# Altium project IOT_IO_v0.PrjPcb
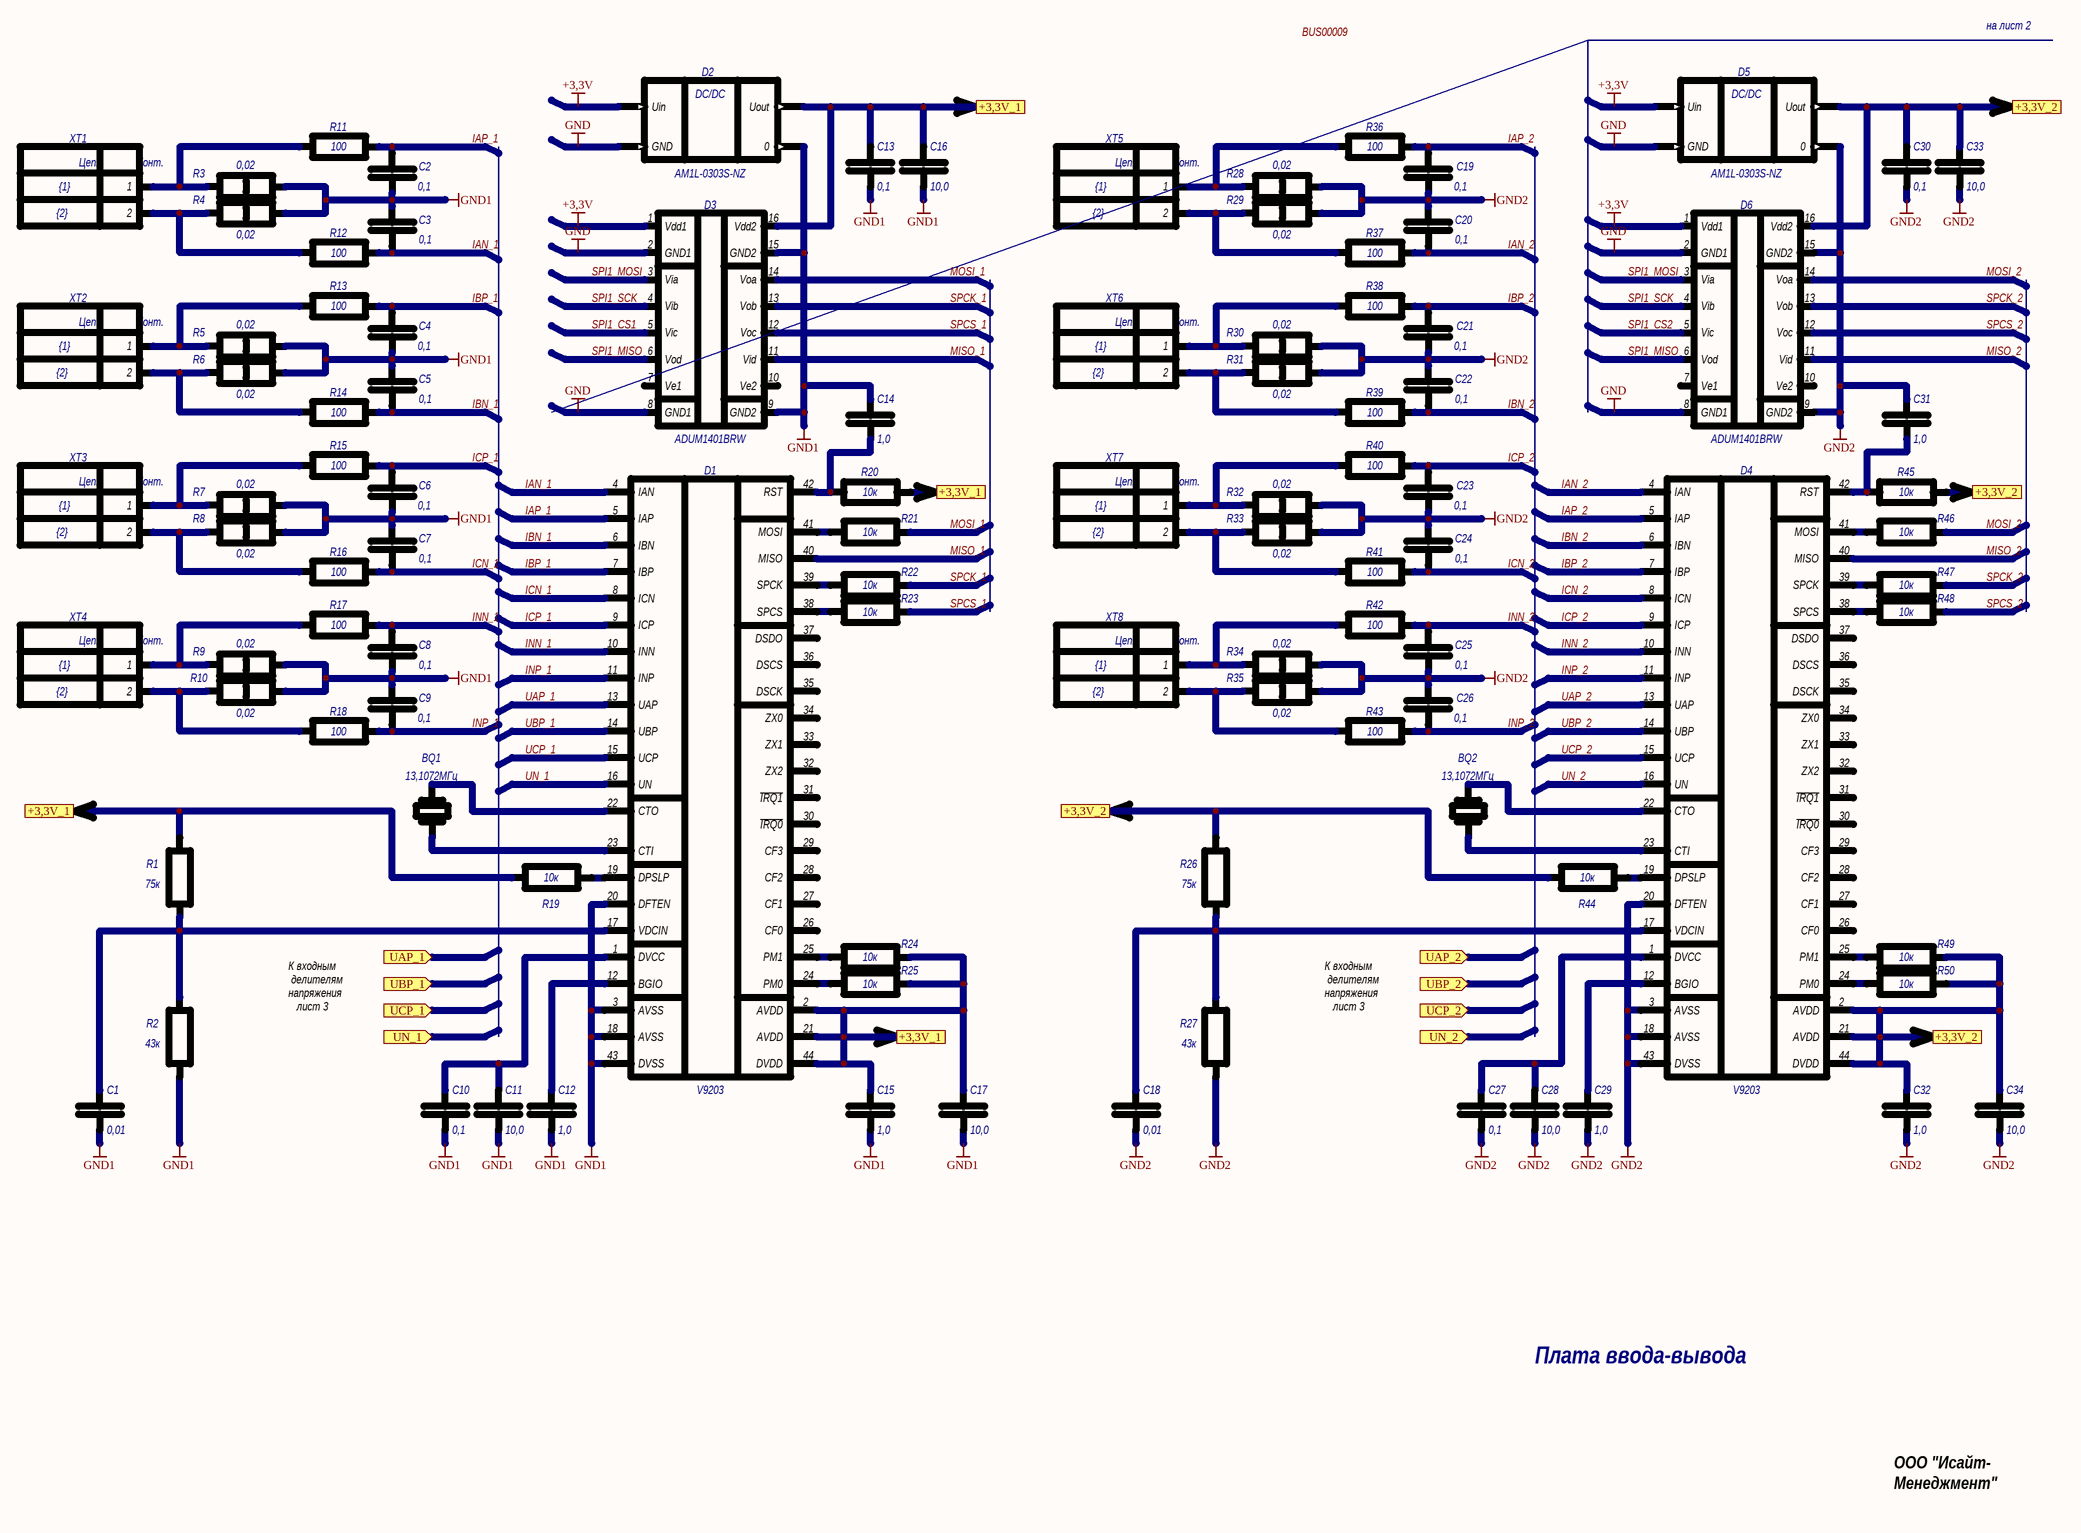
[diagram p0: Sheet1.SCHDOC]
3 sheets, 264 parts. Net scope: global (net labels, ports and power ports of the same name join across sheets).
Board file: IOT_IO_v0.PcbDoc
Sheets:
  Sheet1.SCHDOC
  Sheet3.SCHDOC
  Sheet4.SCHDOC

## Sheet Sheet1.SCHDOC
size 593 x 439 mm; ApprovedBy: ГрибановСВ; CheckedBy: КычкинАВ; Author: СергеевДС; DocumentNumber: ЕМС.02.00.100 Э3; SheetNumber: 1; SheetTotal: 4; DocumentName: Sheet1.SCHDOC

### Parts
BQ1  HC49U-12M  [HC49U]  (value not drawn)
BQ2  HC49U-12M  [HC49U]  (value not drawn)
C1  value 0,01  [0805]  (hidden comment: К0805)
C2  value 0,1  [0805]  (hidden comment: К0805)
C3  value 0,1  [0805]  (hidden comment: К0805)
C4  value 0,1  [0805]  (hidden comment: К0805)
C5  value 0,1  [0805]  (hidden comment: К0805)
C6  value 0,1  [0805]  (hidden comment: К0805)
C7  value 0,1  [0805]  (hidden comment: К0805)
C8  value 0,1  [0805]  (hidden comment: К0805)
C9  value 0,1  [0805]  (hidden comment: К0805)
C10  value 0,1  [0805]  (hidden comment: К0805)
C11  value 10,0  [0805]  (hidden comment: К0805)
C12  value 1,0  [0805]  (hidden comment: К0805)
C13  value 0,1  [0805]  (hidden comment: К0805)
C14  value 1,0  [0805]  (hidden comment: К0805)
C15  value 1,0  [0805]  (hidden comment: К0805)
C16  value 10,0  [0805]  (hidden comment: К0805)
C17  value 10,0  [0805]  (hidden comment: К0805)
C18  value 0,01  [0805]  (hidden comment: К0805)
C19  value 0,1  [0805]  (hidden comment: К0805)
C20  value 0,1  [0805]  (hidden comment: К0805)
C21  value 0,1  [0805]  (hidden comment: К0805)
C22  value 0,1  [0805]  (hidden comment: К0805)
C23  value 0,1  [0805]  (hidden comment: К0805)
C24  value 0,1  [0805]  (hidden comment: К0805)
C25  value 0,1  [0805]  (hidden comment: К0805)
C26  value 0,1  [0805]  (hidden comment: К0805)
C27  value 0,1  [0805]  (hidden comment: К0805)
C28  value 10,0  [0805]  (hidden comment: К0805)
C29  value 1,0  [0805]  (hidden comment: К0805)
C30  value 0,1  [0805]  (hidden comment: К0805)
C31  value 1,0  [0805]  (hidden comment: К0805)
C32  value 1,0  [0805]  (hidden comment: К0805)
C33  value 10,0  [0805]  (hidden comment: К0805)
C34  value 10,0  [0805]  (hidden comment: К0805)
D1  V9203  [TQFP-44]
D2  value AM1L-0303S-NZ  [SIP-4]  (hidden comment: TME0505S)
D3  ADUM1401BRW  [SOL-16]
D4  V9203  [TQFP-44]
D5  value AM1L-0303S-NZ  [SIP-4]  (hidden comment: TME0505S)
D6  ADUM1401BRW  [SOL-16]
R1  Р0805  [0805]  (value not drawn)
R2  Р0805  [0805]  (value not drawn)
R3  value 0,02  [2512]  (hidden comment: Р2512)
R4  value 0,02  [2512]  (hidden comment: Р2512)
R5  value 0,02  [2512]  (hidden comment: Р2512)
R6  value 0,02  [2512]  (hidden comment: Р2512)
R7  value 0,02  [2512]  (hidden comment: Р2512)
R8  value 0,02  [2512]  (hidden comment: Р2512)
R9  value 0,02  [2512]  (hidden comment: Р2512)
R10  value 0,02  [2512]  (hidden comment: Р2512)
R11  value 100  [0805]  (hidden comment: Р0805)
R12  value 100  [0805]  (hidden comment: Р0805)
R13  value 100  [0805]  (hidden comment: Р0805)
R14  value 100  [0805]  (hidden comment: Р0805)
R15  value 100  [0805]  (hidden comment: Р0805)
R16  value 100  [0805]  (hidden comment: Р0805)
R17  value 100  [0805]  (hidden comment: Р0805)
R18  value 100  [0805]  (hidden comment: Р0805)
R19  Р0805  [0805]  (value not drawn)
R20  Р0805  [0805]  (value not drawn)
R21  Р0805  [0805]  (value not drawn)
R22  Р0805  [0805]  (value not drawn)
R23  Р0805  [0805]  (value not drawn)
R24  Р0805  [0805]  (value not drawn)
R25  Р0805  [0805]  (value not drawn)
R26  Р0805  [0805]  (value not drawn)
R27  Р0805  [0805]  (value not drawn)
R28  value 0,02  [2512]  (hidden comment: Р2512)
R29  value 0,02  [2512]  (hidden comment: Р2512)
R30  value 0,02  [2512]  (hidden comment: Р2512)
R31  value 0,02  [2512]  (hidden comment: Р2512)
R32  value 0,02  [2512]  (hidden comment: Р2512)
R33  value 0,02  [2512]  (hidden comment: Р2512)
R34  value 0,02  [2512]  (hidden comment: Р2512)
R35  value 0,02  [2512]  (hidden comment: Р2512)
R36  value 100  [0805]  (hidden comment: Р0805)
R37  value 100  [0805]  (hidden comment: Р0805)
R38  value 100  [0805]  (hidden comment: Р0805)
R39  value 100  [0805]  (hidden comment: Р0805)
R40  value 100  [0805]  (hidden comment: Р0805)
R41  value 100  [0805]  (hidden comment: Р0805)
R42  value 100  [0805]  (hidden comment: Р0805)
R43  value 100  [0805]  (hidden comment: Р0805)
R44  Р0805  [0805]  (value not drawn)
R45  Р0805  [0805]  (value not drawn)
R46  Р0805  [0805]  (value not drawn)
R47  Р0805  [0805]  (value not drawn)
R48  Р0805  [0805]  (value not drawn)
R49  Р0805  [0805]  (value not drawn)
R50  Р0805  [0805]  (value not drawn)
XT1  2: {2}  1: {1}  [EK508V-02P]  (hidden comment: EK508V-02P)
XT2  2: {2}  1: {1}  [EK508V-02P]  (hidden comment: EK508V-02P)
XT3  2: {2}  1: {1}  [EK508V-02P]  (hidden comment: EK508V-02P)
XT4  2: {2}  1: {1}  [EK508V-02P]  (hidden comment: EK508V-02P)
XT5  2: {2}  1: {1}  [EK508V-02P]  (hidden comment: EK508V-02P)
XT6  2: {2}  1: {1}  [EK508V-02P]  (hidden comment: EK508V-02P)
XT7  2: {2}  1: {1}  [EK508V-02P]  (hidden comment: EK508V-02P)
XT8  2: {2}  1: {1}  [EK508V-02P]  (hidden comment: EK508V-02P)

### Ports
+3,3V_1, +3,3V_2, UAP_1 (in), UAP_2 (in), UBP_1 (in), UBP_2 (in), UCP_1 (in), UCP_2 (in), UN_1 (in), UN_2 (in)

### Nets
+3,3V: D2.2(Uin) D3.1(Vdd1) D5.2(Uin) D6.1(Vdd1)
GND: D2.1(GND) D3.2(GND1) D3.8(GND1) D5.1(GND) D6.2(GND1) D6.8(GND1)
GND1: C1.1 C2.2 C3.2 C4.2 C5.2 C6.2 C7.2 C8.1 C9.1 C10.1 C11.1 C12.1 C13.1 C14.2 C15.1 C16.1 C17.1 D1.3(AVSS) D1.18(AVSS) D1.20(DFTEN) D1.43(DVSS) D2.3(0) D3.9(GND2) D3.15(GND2) R2.1 R3.2 R4.2 R5.2 R6.2 R7.2 R8.2 R9.2 R10.2
GND2: C18.1 C19.2 C20.2 C21.2 C22.2 C23.2 C24.2 C25.1 C26.1 C27.1 C28.1 C29.1 C30.1 C31.2 C32.1 C33.1 C34.1 D4.3(AVSS) D4.18(AVSS) D4.20(DFTEN) D4.43(DVSS) D5.3(0) D6.9(GND2) D6.15(GND2) R27.1 R28.2 R29.2 R30.2 R31.2 R32.2 R33.2 R34.2 R35.2
+3,3V_1: C13.2 C15.2 C16.2 C17.2 D1.2(AVDD) D1.21(AVDD) D1.44(DVDD) D2.4(Uout) D3.16(Vdd2) R1.2 R19.2 R20.2 R24.1 R25.1 ; port +3,3V_1
+3,3V_2: C30.2 C32.2 C33.2 C34.2 D4.2(AVDD) D4.21(AVDD) D4.44(DVDD) D5.4(Uout) D6.16(Vdd2) R26.2 R44.2 R45.2 R49.1 R50.1 ; port +3,3V_2
IAN_1: C3.1 D1.4(IAN) R12.1
IAN_2: C20.1 D4.4(IAN) R37.1
IAP_1: C2.1 D1.5(IAP) R11.1
IAP_2: C19.1 D4.5(IAP) R36.1
IBN_1: C5.1 D1.6(IBN) R14.1
IBN_2: C22.1 D4.6(IBN) R39.1
IBP_1: C4.1 D1.7(IBP) R13.1
IBP_2: C21.1 D4.7(IBP) R38.1
ICN_1: C7.1 D1.8(ICN) R16.1
ICN_2: C24.1 D4.8(ICN) R41.1
ICP_1: C6.1 D1.9(ICP) R15.1
ICP_2: C23.1 D4.9(ICP) R40.1
INN_1: C8.2 D1.10(INN) R17.1
INN_2: C25.2 D4.10(INN) R42.1
INP_1: C9.2 D1.11(INP) R18.1
INP_2: C26.2 D4.11(INP) R43.1
MISO_1: D1.40(MISO) D3.11(Vid)
MISO_2: D4.40(MISO) D6.11(Vid)
MOSI_1: D3.14(Voa) R21.1
MOSI_2: D6.14(Voa) R46.1
SPCK_1: D3.13(Vob) R22.1
SPCK_2: D6.13(Vob) R47.1
SPCS_1: D3.12(Voc) R23.1
SPCS_2: D6.12(Voc) R48.1
SPI1_CS1: D3.5(Vic)
SPI1_CS2: D6.5(Vic)
SPI1_MISO: D3.6(Vod) D6.6(Vod)
SPI1_MOSI: D3.3(Via) D6.3(Via)
SPI1_SCK: D3.4(Vib) D6.4(Vib)
UAP_1: D1.13(UAP)
UAP_2: D4.13(UAP)
UBP_1: D1.14(UBP)
UBP_2: D4.14(UBP)
UCP_1: D1.15(UCP)
UCP_2: D4.15(UCP)
UN_1: D1.16(UN)
UN_2: D4.16(UN)
NetBQ1_1: BQ1.1 D1.23(CTI)
NetBQ1_2: BQ1.2 D1.22(CTO)
NetBQ2_1: BQ2.1 D4.23(CTI)
NetBQ2_2: BQ2.2 D4.22(CTO)
NetC1_2: C1.2 D1.17(VDCIN) R1.1 R2.2
NetC10_2: C10.2 C11.2 D1.1(DVCC)
NetC12_2: C12.2 D1.12(BGIO)
NetC14_1: C14.1 D1.42(RST) R20.1
NetC18_2: C18.2 D4.17(VDCIN) R26.1 R27.2
NetC27_2: C27.2 C28.2 D4.1(DVCC)
NetC29_2: C29.2 D4.12(BGIO)
NetC31_1: C31.1 D4.42(RST) R45.1
NetD1_19: D1.19(DPSLP) R19.1
NetD1_24: D1.24(PM0) R25.2
NetD1_25: D1.25(PM1) R24.2
NetD1_38: D1.38(SPCS) R23.2
NetD1_39: D1.39(SPCK) R22.2
NetD1_41: D1.41(MOSI) R21.2
NetD4_19: D4.19(DPSLP) R44.1
NetD4_24: D4.24(PM0) R50.2
NetD4_25: D4.25(PM1) R49.2
NetD4_38: D4.38(SPCS) R48.2
NetD4_39: D4.39(SPCK) R47.2
NetD4_41: D4.41(MOSI) R46.2
NetR3_1: R3.1 R11.2 XT1.1
NetR4_1: R4.1 R12.2 XT1.2
NetR5_1: R5.1 R13.2 XT2.1
NetR6_1: R6.1 R14.2 XT2.2
NetR7_1: R7.1 R15.2 XT3.1
NetR8_1: R8.1 R16.2 XT3.2
NetR9_1: R9.1 R17.2 XT4.1
NetR10_1: R10.1 R18.2 XT4.2
NetR28_1: R28.1 R36.2 XT5.1
NetR29_1: R29.1 R37.2 XT5.2
NetR30_1: R30.1 R38.2 XT6.1
NetR31_1: R31.1 R39.2 XT6.2
NetR32_1: R32.1 R40.2 XT7.1
NetR33_1: R33.1 R41.2 XT7.2
NetR34_1: R34.1 R42.2 XT8.1
NetR35_1: R35.1 R43.2 XT8.2

Not connected (* = marked no-connect by the designer): D1 26(CF0) 27(CF1) 28(CF2) 29(CF3) 30(~{IRQ0}) 31(~{IRQ1}) 32(ZX2) 33(ZX1) 34(ZX0) 35(DSCK) 36(DSCS) 37(DSDO); D3 7(Ve1) 10(Ve2); D4 26(CF0) 27(CF1) 28(CF2) 29(CF3) 30(~{IRQ0}) 31(~{IRQ1}) 32(ZX2) 33(ZX1) 34(ZX0) 35(DSCK) 36(DSCS) 37(DSDO); D6 7(Ve1) 10(Ve2)

### Notes on the sheet
- на лист 2
- К входным
  делителям
  напряжения
  лист 3
- Плата ввода-вывода
- ООО "Исайт-
  Менеджмент"
- Labels drawn without touching a wire or pin: BUS00009
- Перв. примен.
- Справ. №
- Подп. и дата
- Инв. № дубл.
- Взам. инв. №
- Изм.
- Лист
- № докум.
- Подп.
- Дата
- Литера
- Масса
- Масштаб
- Пров.
- Разраб.
- О
- 1
- _
- Инв. № подл.
- Н.контр.
- Схема электрическая
  принципиальная
- Листов
- Утв.
- (in symbol EK508V-02P) Цепь; Конт.
- (in symbol HC49U-12M) 13,1072МГц
- (in symbol TME0505S) DC/DC
- (in symbol Р0805) 43к; 75к
- (in symbol Р0805_VARIANT_1) 10к

### Library data of the parts
BQ1 BQ2 = HC49U-12M: РЕЗОНАТОР; TG: {TG}; TO: 020, 211/-/12.0М; TU: {TU}; NO: 0524; RefDes2: {RefDes2}; ComponentHeight: {ComponentHeight}
C1-C34 = К0805: КОНДЕНСАТОР; TG: NP0; TO: 5%; TU: {TU}; NO: {NO}; RefDes2: {RefDes2}; ComponentHeight: 1
D1 D4 = V9203: {Description}; TG: {TG}; NO: {NO}; RefDes2: {RefDes2}; TU: {TU}; TO: {TO}; ComponentHeight: {ComponentHeight}
D2 D5 = TME0505S: МИКРОСХЕМА; TO: 320/SIP-4/SZ; TU: TRACO, AIMTEC; NO: 0007; RefDes2: {RefDes2}; ComponentHeight: 10
R1 R2 R26 R27 = Р0805: РЕЗИСТОР; TG: 0,125; TO: 1%; TU: {TU}; NO: {NO}; RefDes2: {RefDes2}; ComponentHeight: 1
R3-R10 R28-R35 = Р2512: РЕЗИСТОР; TG: 1; TO: 5%; TU: {TU}; NO: {NO}; RefDes2: {RefDes2}; ComponentHeight: 1.2
R11-R25 R36-R50 = Р0805_VARIANT_1: РЕЗИСТОР; TG: 0,125; TO: 1%; TU: {TU}; NO: {NO}; RefDes2: {RefDes2}; ComponentHeight: 1
XT1-XT8 = EK508V-02P: {Description}; Value: 5.08; TU: {TU}; TG: {TG}; RefDes2: {RefDes2}; TO: {TO}; NO: {NO}; N1: {N1}; N2: {N2}; ComponentHeight: {ComponentHeight}

## Sheet Sheet3.SCHDOC
size 593 x 439 mm; DocumentNumber: ЕМС.02.00.100 Э3; SheetNumber: 3; SheetTotal: 4; DocumentName: Sheet3.SCHDOC
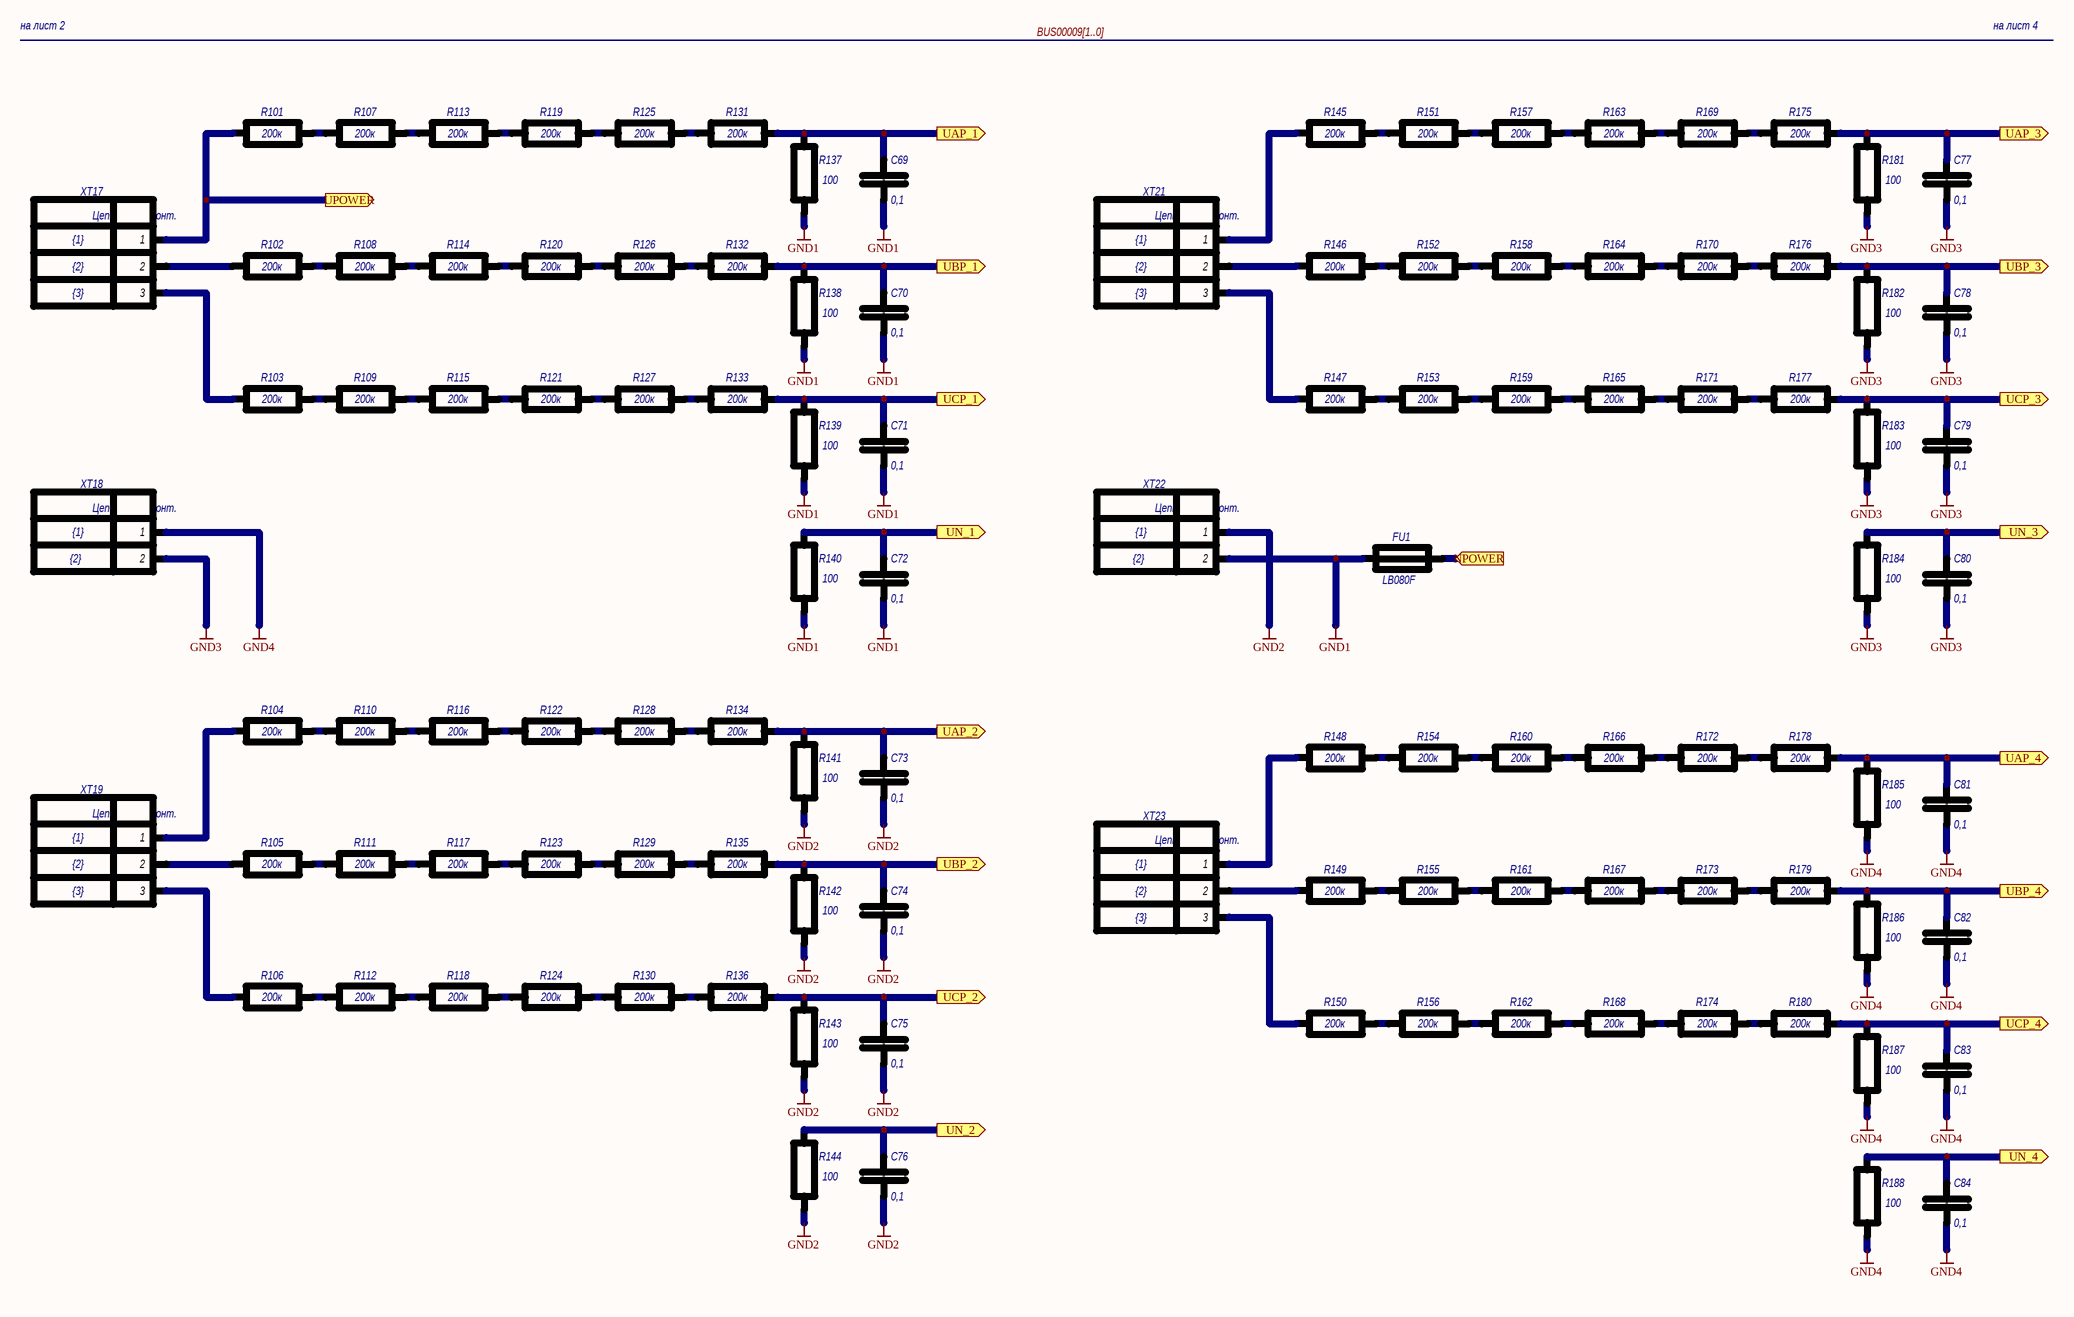
[diagram p1: Sheet3.SCHDOC]

### Parts
C69  value 0,1  [0805]  (hidden comment: К0805)
C70  value 0,1  [0805]  (hidden comment: К0805)
C71  value 0,1  [0805]  (hidden comment: К0805)
C72  value 0,1  [0805]  (hidden comment: К0805)
C73  value 0,1  [0805]  (hidden comment: К0805)
C74  value 0,1  [0805]  (hidden comment: К0805)
C75  value 0,1  [0805]  (hidden comment: К0805)
C76  value 0,1  [0805]  (hidden comment: К0805)
C77  value 0,1  [0805]  (hidden comment: К0805)
C78  value 0,1  [0805]  (hidden comment: К0805)
C79  value 0,1  [0805]  (hidden comment: К0805)
C80  value 0,1  [0805]  (hidden comment: К0805)
C81  value 0,1  [0805]  (hidden comment: К0805)
C82  value 0,1  [0805]  (hidden comment: К0805)
C83  value 0,1  [0805]  (hidden comment: К0805)
C84  value 0,1  [0805]  (hidden comment: К0805)
FU1  LB080F  [LB080F]
R101  Р1206  [1206]  (value not drawn)
R102  Р1206  [1206]  (value not drawn)
R103  Р1206  [1206]  (value not drawn)
R104  Р1206  [1206]  (value not drawn)
R105  Р1206  [1206]  (value not drawn)
R106  Р1206  [1206]  (value not drawn)
R107  Р1206  [1206]  (value not drawn)
R108  Р1206  [1206]  (value not drawn)
R109  Р1206  [1206]  (value not drawn)
R110  Р1206  [1206]  (value not drawn)
R111  Р1206  [1206]  (value not drawn)
R112  Р1206  [1206]  (value not drawn)
R113  Р1206  [1206]  (value not drawn)
R114  Р1206  [1206]  (value not drawn)
R115  Р1206  [1206]  (value not drawn)
R116  Р1206  [1206]  (value not drawn)
R117  Р1206  [1206]  (value not drawn)
R118  Р1206  [1206]  (value not drawn)
R119  Р1206  [1206]  (value not drawn)
R120  Р1206  [1206]  (value not drawn)
R121  Р1206  [1206]  (value not drawn)
R122  Р1206  [1206]  (value not drawn)
R123  Р1206  [1206]  (value not drawn)
R124  Р1206  [1206]  (value not drawn)
R125  Р1206  [1206]  (value not drawn)
R126  Р1206  [1206]  (value not drawn)
R127  Р1206  [1206]  (value not drawn)
R128  Р1206  [1206]  (value not drawn)
R129  Р1206  [1206]  (value not drawn)
R130  Р1206  [1206]  (value not drawn)
R131  Р1206  [1206]  (value not drawn)
R132  Р1206  [1206]  (value not drawn)
R133  Р1206  [1206]  (value not drawn)
R134  Р1206  [1206]  (value not drawn)
R135  Р1206  [1206]  (value not drawn)
R136  Р1206  [1206]  (value not drawn)
R137  value 100  [0805]  (hidden comment: Р0805)
R138  value 100  [0805]  (hidden comment: Р0805)
R139  value 100  [0805]  (hidden comment: Р0805)
R140  value 100  [0805]  (hidden comment: Р0805)
R141  value 100  [0805]  (hidden comment: Р0805)
R142  value 100  [0805]  (hidden comment: Р0805)
R143  value 100  [0805]  (hidden comment: Р0805)
R144  value 100  [0805]  (hidden comment: Р0805)
R145  Р1206  [1206]  (value not drawn)
R146  Р1206  [1206]  (value not drawn)
R147  Р1206  [1206]  (value not drawn)
R148  Р1206  [1206]  (value not drawn)
R149  Р1206  [1206]  (value not drawn)
R150  Р1206  [1206]  (value not drawn)
R151  Р1206  [1206]  (value not drawn)
R152  Р1206  [1206]  (value not drawn)
R153  Р1206  [1206]  (value not drawn)
R154  Р1206  [1206]  (value not drawn)
R155  Р1206  [1206]  (value not drawn)
R156  Р1206  [1206]  (value not drawn)
R157  Р1206  [1206]  (value not drawn)
R158  Р1206  [1206]  (value not drawn)
R159  Р1206  [1206]  (value not drawn)
R160  Р1206  [1206]  (value not drawn)
R161  Р1206  [1206]  (value not drawn)
R162  Р1206  [1206]  (value not drawn)
R163  Р1206  [1206]  (value not drawn)
R164  Р1206  [1206]  (value not drawn)
R165  Р1206  [1206]  (value not drawn)
R166  Р1206  [1206]  (value not drawn)
R167  Р1206  [1206]  (value not drawn)
R168  Р1206  [1206]  (value not drawn)
R169  Р1206  [1206]  (value not drawn)
R170  Р1206  [1206]  (value not drawn)
R171  Р1206  [1206]  (value not drawn)
R172  Р1206  [1206]  (value not drawn)
R173  Р1206  [1206]  (value not drawn)
R174  Р1206  [1206]  (value not drawn)
R175  Р1206  [1206]  (value not drawn)
R176  Р1206  [1206]  (value not drawn)
R177  Р1206  [1206]  (value not drawn)
R178  Р1206  [1206]  (value not drawn)
R179  Р1206  [1206]  (value not drawn)
R180  Р1206  [1206]  (value not drawn)
R181  value 100  [0805]  (hidden comment: Р0805)
R182  value 100  [0805]  (hidden comment: Р0805)
R183  value 100  [0805]  (hidden comment: Р0805)
R184  value 100  [0805]  (hidden comment: Р0805)
R185  value 100  [0805]  (hidden comment: Р0805)
R186  value 100  [0805]  (hidden comment: Р0805)
R187  value 100  [0805]  (hidden comment: Р0805)
R188  value 100  [0805]  (hidden comment: Р0805)
XT17  2: {2}  1: {1}  3: {3}  [EK508V-03P]  (hidden comment: EK508V-03P)
XT18  2: {2}  1: {1}  [EK508V-02P]  (hidden comment: EK508V-02P)
XT19  2: {2}  1: {1}  3: {3}  [EK508V-03P]  (hidden comment: EK508V-03P)
XT21  2: {2}  1: {1}  3: {3}  [EK508V-03P]  (hidden comment: EK508V-03P)
XT22  2: {2}  1: {1}  [EK508V-02P]  (hidden comment: EK508V-02P)
XT23  2: {2}  1: {1}  3: {3}  [EK508V-03P]  (hidden comment: EK508V-03P)

### Ports
NPOWER (in), UAP_1 (out), UAP_2 (out), UAP_3 (out), UAP_4 (out), UBP_1 (out), UBP_2 (out), UBP_3 (out), UBP_4 (out), UCP_1 (out), UCP_2 (out), UCP_3 (out), UCP_4 (out), UN_1 (out), UN_2 (out), UN_3 (out), UN_4 (out), UPOWER (out)

### Nets
GND1: C69.1 C70.1 C71.1 C72.1 FU1.1 R137.1 R138.1 R139.1 R140.1 XT22.2
GND2: C73.1 C74.1 C75.1 C76.1 R141.1 R142.1 R143.1 R144.1 XT22.1
GND3: C77.1 C78.1 C79.1 C80.1 R181.1 R182.1 R183.1 R184.1 XT18.2
GND4: C81.1 C82.1 C83.1 C84.1 R185.1 R186.1 R187.1 R188.1 XT18.1
NPOWER: FU1.2 ; port NPOWER
UAP_1: C69.2 R131.1 R137.2 ; port UAP_1
UAP_2: C73.2 R134.1 R141.2 ; port UAP_2
UAP_3: C77.2 R175.1 R181.2 ; port UAP_3
UAP_4: C81.2 R178.1 R185.2 ; port UAP_4
UBP_1: C70.2 R132.1 R138.2 ; port UBP_1
UBP_2: C74.2 R135.1 R142.2 ; port UBP_2
UBP_3: C78.2 R176.1 R182.2 ; port UBP_3
UBP_4: C82.2 R179.1 R186.2 ; port UBP_4
UCP_1: C71.2 R133.1 R139.2 ; port UCP_1
UCP_2: C75.2 R136.1 R143.2 ; port UCP_2
UCP_3: C79.2 R177.1 R183.2 ; port UCP_3
UCP_4: C83.2 R180.1 R187.2 ; port UCP_4
UN_1: C72.2 R140.2 ; port UN_1
UN_2: C76.2 R144.2 ; port UN_2
UN_3: C80.2 R184.2 ; port UN_3
UN_4: C84.2 R188.2 ; port UN_4
UPOWER: R101.1 XT17.1 ; port UPOWER
NetR101_2: R101.2 R107.1
NetR102_1: R102.1 XT17.2
NetR102_2: R102.2 R108.1
NetR103_1: R103.1 XT17.3
NetR103_2: R103.2 R109.1
NetR104_1: R104.1 XT19.1
NetR104_2: R104.2 R110.1
NetR105_1: R105.1 XT19.2
NetR105_2: R105.2 R111.1
NetR106_1: R106.1 XT19.3
NetR106_2: R106.2 R112.1
NetR107_2: R107.2 R113.1
NetR108_2: R108.2 R114.1
NetR109_2: R109.2 R115.1
NetR110_2: R110.2 R116.1
NetR111_2: R111.2 R117.1
NetR112_2: R112.2 R118.1
NetR113_2: R113.2 R119.2
NetR114_2: R114.2 R120.2
NetR115_2: R115.2 R121.2
NetR116_2: R116.2 R122.2
NetR117_2: R117.2 R123.2
NetR118_2: R118.2 R124.2
NetR119_1: R119.1 R125.2
NetR120_1: R120.1 R126.2
NetR121_1: R121.1 R127.2
NetR122_1: R122.1 R128.2
NetR123_1: R123.1 R129.2
NetR124_1: R124.1 R130.2
NetR125_1: R125.1 R131.2
NetR126_1: R126.1 R132.2
NetR127_1: R127.1 R133.2
NetR128_1: R128.1 R134.2
NetR129_1: R129.1 R135.2
NetR130_1: R130.1 R136.2
NetR145_1: R145.1 XT21.1
NetR145_2: R145.2 R151.1
NetR146_1: R146.1 XT21.2
NetR146_2: R146.2 R152.1
NetR147_1: R147.1 XT21.3
NetR147_2: R147.2 R153.1
NetR148_1: R148.1 XT23.1
NetR148_2: R148.2 R154.1
NetR149_1: R149.1 XT23.2
NetR149_2: R149.2 R155.1
NetR150_1: R150.1 XT23.3
NetR150_2: R150.2 R156.1
NetR151_2: R151.2 R157.1
NetR152_2: R152.2 R158.1
NetR153_2: R153.2 R159.1
NetR154_2: R154.2 R160.1
NetR155_2: R155.2 R161.1
NetR156_2: R156.2 R162.1
NetR157_2: R157.2 R163.2
NetR158_2: R158.2 R164.2
NetR159_2: R159.2 R165.2
NetR160_2: R160.2 R166.2
NetR161_2: R161.2 R167.2
NetR162_2: R162.2 R168.2
NetR163_1: R163.1 R169.2
NetR164_1: R164.1 R170.2
NetR165_1: R165.1 R171.2
NetR166_1: R166.1 R172.2
NetR167_1: R167.1 R173.2
NetR168_1: R168.1 R174.2
NetR169_1: R169.1 R175.2
NetR170_1: R170.1 R176.2
NetR171_1: R171.1 R177.2
NetR172_1: R172.1 R178.2
NetR173_1: R173.1 R179.2
NetR174_1: R174.1 R180.2

### Buses and harness runs
bus BUS00009[1..0]

### Notes on the sheet
- на лист 2
- на лист 4
- Подп. и дата
- Инв. № дубл.
- Взам. инв. №
- Инв. № подл.
- Лист
- Изм.
- № докум.
- Подп.
- Дата
- (in symbol EK508V-02P) Цепь; Конт.
- (in symbol EK508V-03P) Цепь; Конт.
- (in symbol Р1206) 200к

### Library data of the parts
C69-C84 = К0805: as C1 on sheet Sheet1; ComponentHeight: 1
FU1 = LB080F: {Description}; TU: {TU}; TG: {TG}; RefDes2: {RefDes2}; TO: {TO}; NO: {NO}; ComponentHeight: {ComponentHeight}
R101-R136 R145-R180 = Р1206: РЕЗИСТОР; TG: 0,25; TO: 5%; TU: {TU}; NO: {NO}; RefDes2: {RefDes2}; ComponentHeight: 1.2
R137-R144 R181-R188 = Р0805_VARIANT_1: as R11 on sheet Sheet1; ComponentHeight: 1
XT17 XT19 XT21 XT23 = EK508V-03P: {Description}; Value: 5.08; TU: {TU}; TG: {TG}; TO: {TO}; NO: {NO}; RefDes2: {RefDes2}; N1: {N1}; N2: {N2}; N3: {N3}; ComponentHeight: {ComponentHeight}
XT18 XT22 = EK508V-02P: as XT1 on sheet Sheet1; ComponentHeight: {ComponentHeight}

## Sheet Sheet4.SCHDOC
size 593 x 439 mm; DocumentNumber: ЕМС.02.00.100 Э3; SheetNumber: 4; SheetTotal: 4; DocumentName: Sheet4.SCHDOC
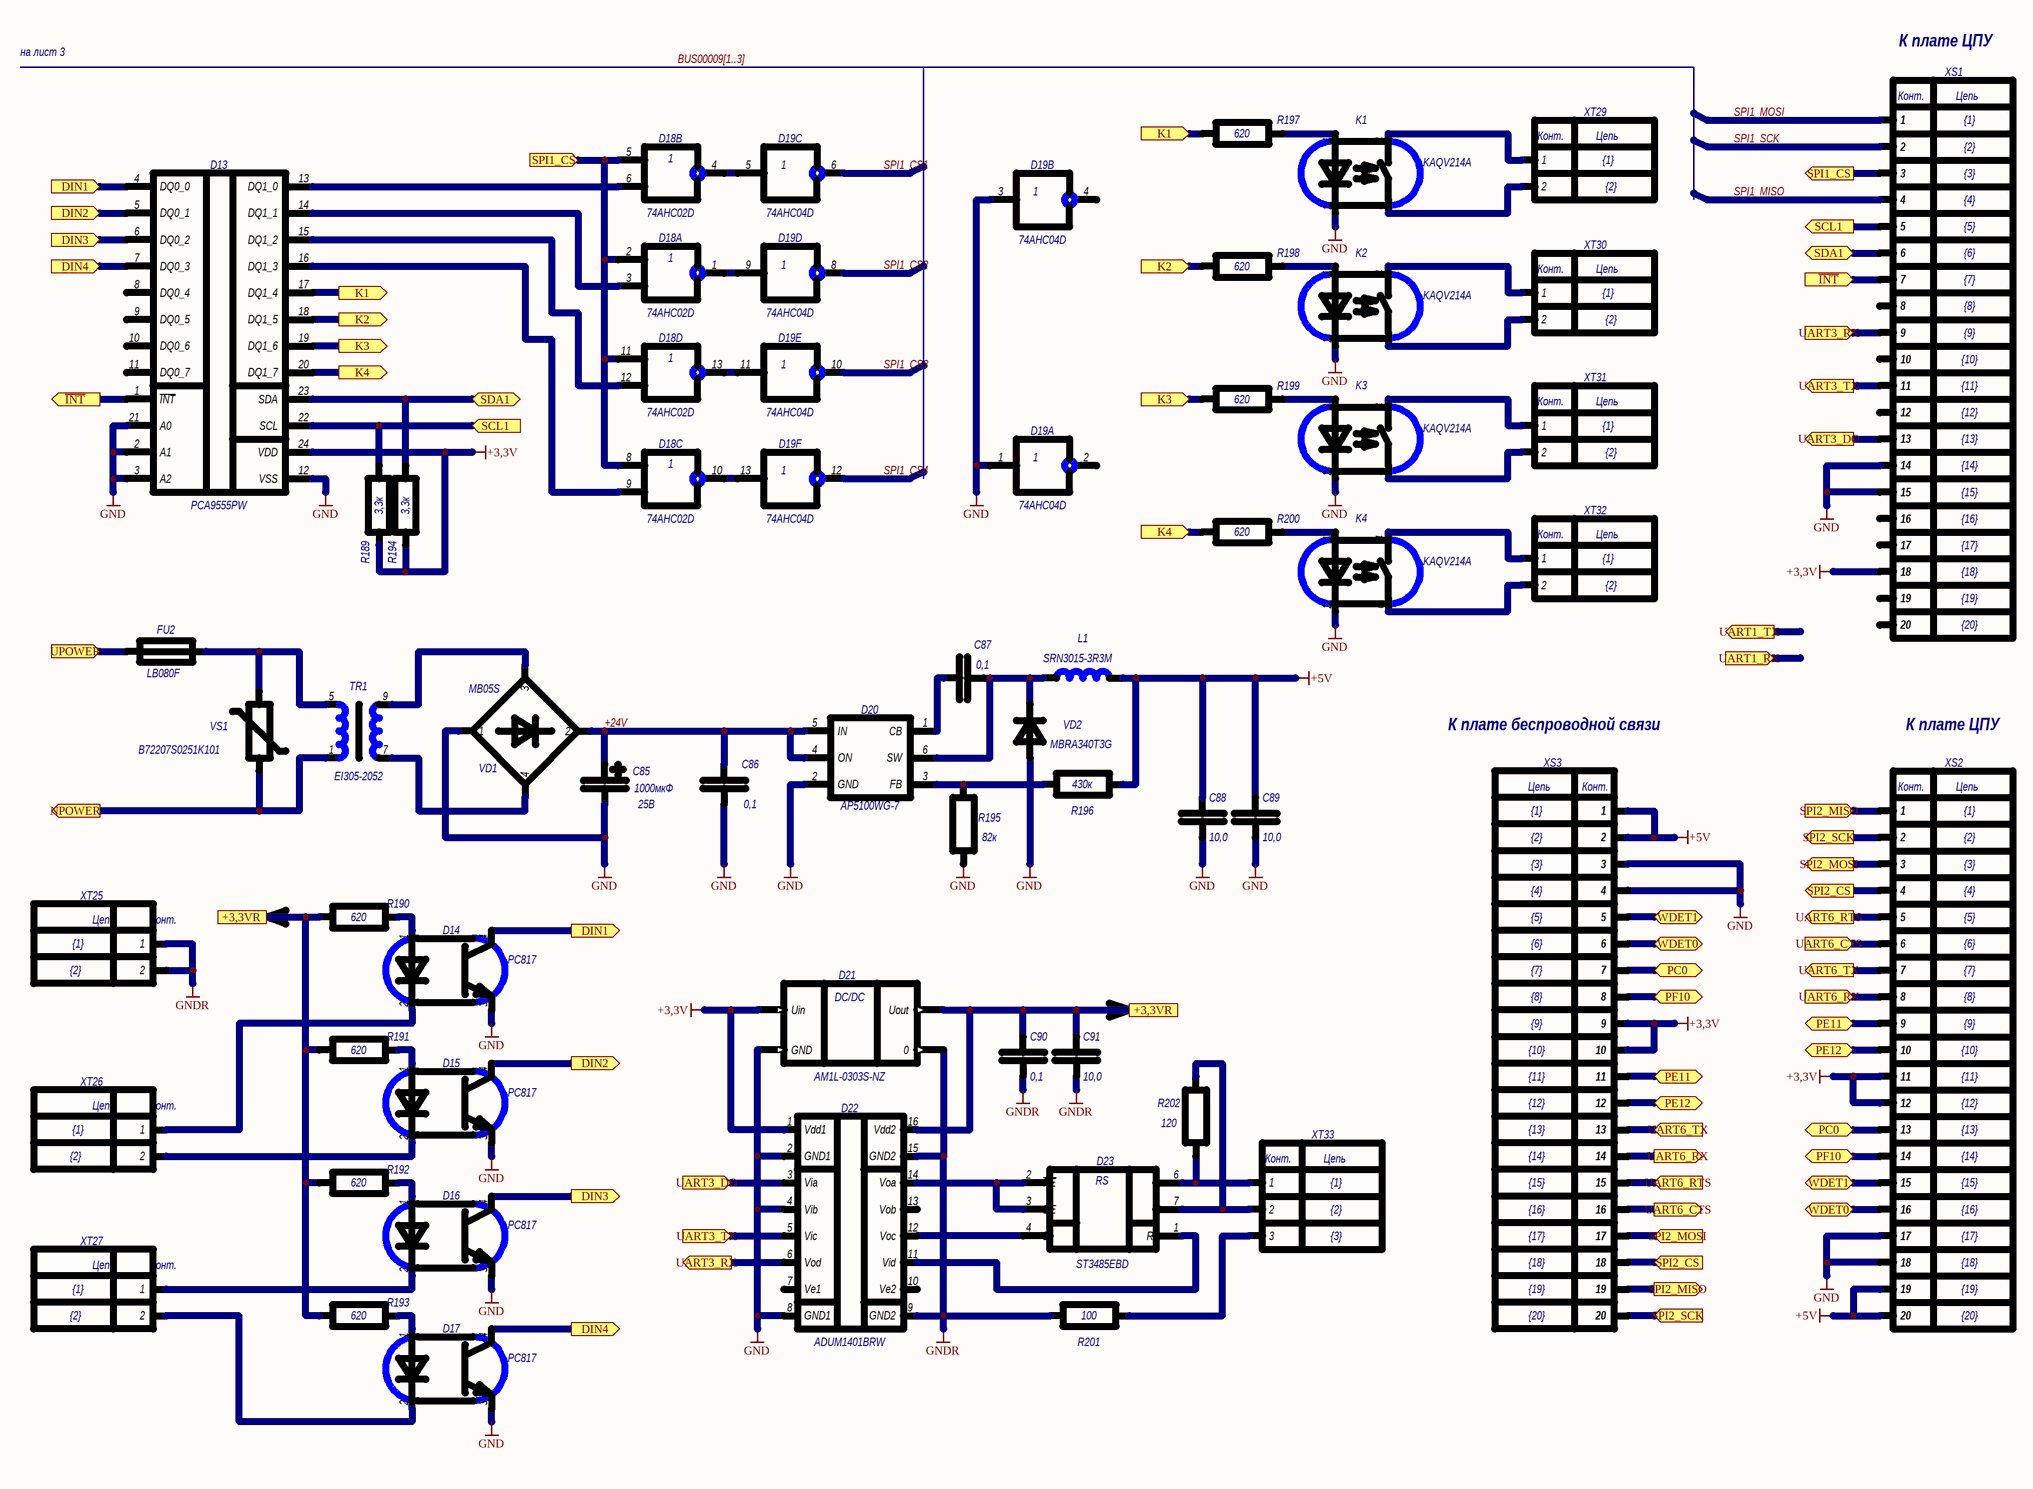
[diagram p2: Sheet4.SCHDOC]

### Parts
C85  value 1000мкФ  TG: 25В  [К50-35]  (hidden comment: К50-35)
C86  value 0,1  [0805]  (hidden comment: К0805)
C87  value 0,1  [0805]  (hidden comment: К0805)
C88  value 10,0  [0805]  (hidden comment: К0805)
C89  value 10,0  [0805]  (hidden comment: К0805)
C90  value 0,1  [0805]  (hidden comment: К0805)
C91  value 10,0  [0805]  (hidden comment: К0805)
D13  PCA9555PW  [TSSOP-24]
D14  PC817  [DIP-04]
D15  PC817  [DIP-04]
D16  PC817  [DIP-04]
D17  PC817  [DIP-04]
D18  74AHC02D  [SO-14]  (parts A,B,C,D of 4)
D19  74AHC04D  [SO-14]  (parts A,B,C,D,E,F of 6)
D20  AP5100WG-7  [SOT-23-6]
D21  value AM1L-0303S-NZ  [SIP-4]  (hidden comment: TME0505S)
D22  ADUM1401BRW  [SOL-16]
D23  ST3485EBD  [SO-08]
FU2  LB080F  [LB080F]
K1  KAQV214A  [DIP-6S]
K2  KAQV214A  [DIP-6S]
K3  KAQV214A  [DIP-6S]
K4  KAQV214A  [DIP-6S]
L1  value SRN3015-3R3M  [SRN3015]  (hidden comment: SRN3015-101M)
R189  Р0805  [0805]  (value not drawn)
R190  value 620  [0805]  (hidden comment: Р0805)
R191  value 620  [0805]  (hidden comment: Р0805)
R192  value 620  [0805]  (hidden comment: Р0805)
R193  value 620  [0805]  (hidden comment: Р0805)
R194  Р0805  [0805]  (value not drawn)
R195  Р0805  [0805]  (value not drawn)
R196  Р0805  [0805]  (value not drawn)
R197  value 620  [0805]  (hidden comment: Р0805)
R198  value 620  [0805]  (hidden comment: Р0805)
R199  value 620  [0805]  (hidden comment: Р0805)
R200  value 620  [0805]  (hidden comment: Р0805)
R201  value 100  [0805]  (hidden comment: Р0805)
R202  value 120  [0805]  (hidden comment: Р0805)
TR1  EI305-2052  [EI305-2052]
VD1  MB05S  [MB10]
VD2  MBRA340T3G  [SMA]
VS1  B72207S0251K101  [B72207S0251K101]
XS1  18: {18}  15: {15}  12: {12}  9: {9}  6: {6}  3: {3}  1: {1}  19: {19}  16: {16}  20: {20}  17: {17}  13: {13}  10: {10}  14: {14}  11: {11}  7: {7}  4: {4}  8: {8}  5: {5}  2: {2}  [PBD-20WRLES]  (hidden comment: PBD-20WRLES)
XS2  18: {18}  15: {15}  12: {12}  9: {9}  6: {6}  3: {3}  1: {1}  19: {19}  16: {16}  20: {20}  17: {17}  13: {13}  10: {10}  14: {14}  11: {11}  7: {7}  4: {4}  8: {8}  5: {5}  2: {2}  [PBD-20WRLES]  (hidden comment: PBD-20WRLES)
XS3  18: {18}  15: {15}  12: {12}  9: {9}  6: {6}  3: {3}  1: {1}  19: {19}  16: {16}  20: {20}  17: {17}  13: {13}  10: {10}  14: {14}  11: {11}  7: {7}  4: {4}  8: {8}  5: {5}  2: {2}  [PBD-20WRLES]  (hidden comment: PBD-20WRLES)
XT25  2: {2}  1: {1}  [EK508V-02P]  (hidden comment: EK508V-02P)
XT26  2: {2}  1: {1}  [EK508V-02P]  (hidden comment: EK508V-02P)
XT27  2: {2}  1: {1}  [EK508V-02P]  (hidden comment: EK508V-02P)
XT29  2: {2}  1: {1}  [EK508V-02P]  (hidden comment: EK508V-02P)
XT30  2: {2}  1: {1}  [EK508V-02P]  (hidden comment: EK508V-02P)
XT31  2: {2}  1: {1}  [EK508V-02P]  (hidden comment: EK508V-02P)
XT32  2: {2}  1: {1}  [EK508V-02P]  (hidden comment: EK508V-02P)
XT33  2: {2}  1: {1}  3: {3}  [EK508V-03P]  (hidden comment: EK508V-03P)

### Ports
+3,3VR, DIN1 (in), DIN1 (out), DIN2 (in), DIN2 (out), DIN3 (in), DIN3 (out), DIN4 (in), DIN4 (out), K1 (in), K1 (out), K2 (in), K2 (out), K3 (in), K3 (out), K4 (in), K4 (out), NPOWER (out), PC0 (bidir), PE11 (bidir), PE12 (bidir), PF10 (bidir), SCL1 (in), SCL1 (out), SDA1 (bidir), SPI1_CS (in), SPI1_CS (out), SPI2_CS (in), SPI2_CS (out), SPI2_MISO (in), SPI2_MISO (out), SPI2_MOSI (in), SPI2_MOSI (out), SPI2_SCK (in), SPI2_SCK (out), UART1_RX (in), UART1_TX (out), UART3_DO (in), UART3_DO (out), UART3_RX (in), UART3_RX (out), UART3_TX (in), UART3_TX (out), UART6_CTS (in), UART6_CTS (out), UART6_RTS (in), UART6_RTS (out), UART6_RX (in), UART6_RX (out), UART6_TX (in), UART6_TX (out), UPOWER (in), WDET0 (bidir), WDET1 (bidir), ~{INT} (in), ~{INT} (out)

### Nets
+3,3V: D13.24(VDD) D18.14(+3,3V) D19.14(+3,3V) D21.2(Uin) D22.1(Vdd1) R189.1 R194.1 XS1.18 XS2.11 XS2.12 XS3.9 XS3.10
+3,3VR: D23.8(+V)
+5V: C88.2 C89.2 L1.2 R196.1 XS2.19 XS2.20 XS3.1 XS3.2
GND: C85.2(Minus) C86.1 C88.1 C89.1 D13.2(A1) D13.3(A2) D13.12(VSS) D13.21(A0) D14.3(Emit) D15.3(Emit) D16.3(Emit) D17.3(Emit) D18.7(GND) D19.1(In) D19.3(In) D19.7(GND) D20.2(GND) D21.1(GND) D22.2(GND1) D22.4(Vib) D22.8(GND1) K1.2(Katod) K2.2(Katod) K3.2(Katod) K4.2(Katod) R195.1 VD1.1 VD2.A(Anod) XS1.14 XS1.15 XS2.17 XS2.18 XS3.3 XS3.4
GNDR: C90.1 C91.1 D21.3(0) D22.9(GND2) D22.15(GND2) D23.5(GND) R201.2 XT25.1 XT25.2
+3,3VR: C90.2 C91.2 D21.4(Uout) D22.16(Vdd2) R190.1 R191.1 R192.1 R193.1 ; port +3,3VR  [a separate net that carries the same name]
+24V: C85.1(Plus) C86.2 D20.4(ON) D20.5(IN) VD1.2
DIN1: D13.4(DQ0_0) D14.4(Koll) ; port DIN1
DIN2: D13.5(DQ0_1) D15.4(Koll) ; port DIN2
DIN3: D13.6(DQ0_2) D16.4(Koll) ; port DIN3
DIN4: D13.7(DQ0_3) D17.4(Koll) ; port DIN4
~{INT}: D13.1(~{INT}) XS1.7 ; port ~{INT}
K1: D13.17(DQ1_4) R197.1 ; port K1
K2: D13.18(DQ1_5) R198.1 ; port K2
K3: D13.19(DQ1_6) R199.1 ; port K3
K4: D13.20(DQ1_7) R200.1 ; port K4
NPOWER: TR1.1 VS1.1 ; port NPOWER
PC0: XS2.13 XS3.7 ; port PC0
PE11: XS2.9 XS3.11 ; port PE11
PE12: XS2.10 XS3.12 ; port PE12
PF10: XS2.14 XS3.8 ; port PF10
SCL1: D13.22(SCL) R189.2 XS1.5 ; port SCL1
SDA1: D13.23(SDA) R194.2 XS1.6 ; port SDA1
SPI1_CS: D18.2(In) D18.5(In) D18.8(In) D18.11(In) XS1.3 ; port SPI1_CS
SPI1_CS1: D19.6(Out)
SPI1_CS2: D19.8(Out)
SPI1_CS3: D19.10(Out)
SPI1_CS4: D19.12(Out)
SPI1_MISO: XS1.4
SPI1_MOSI: XS1.1
SPI1_SCK: XS1.2
SPI2_CS: XS2.4 XS3.18 ; port SPI2_CS
SPI2_MISO: XS2.1 XS3.19 ; port SPI2_MISO
SPI2_MOSI: XS2.3 XS3.17 ; port SPI2_MOSI
SPI2_SCK: XS2.2 XS3.20 ; port SPI2_SCK
UART3_DO: D22.3(Via) XS1.13 ; port UART3_DO
UART3_RX: D22.6(Vod) XS1.9 ; port UART3_RX
UART3_TX: D22.5(Vic) XS1.11 ; port UART3_TX
UART6_CTS: XS2.6 XS3.16 ; port UART6_CTS
UART6_RTS: XS2.5 XS3.15 ; port UART6_RTS
UART6_RX: XS2.8 XS3.14 ; port UART6_RX
UART6_TX: XS2.7 XS3.13 ; port UART6_TX
UPOWER: FU2.1 ; port UPOWER
WDET0: XS2.16 XS3.6 ; port WDET0
WDET1: XS2.15 XS3.5 ; port WDET1
NetC87_1: C87.1 D20.1(CB)
NetC87_2: C87.2 D20.6(SW) L1.1 VD2.K(Katod)
NetD13_13: D13.13(DQ1_0) D18.6(In)
NetD13_14: D13.14(DQ1_1) D18.3(In)
NetD13_15: D13.15(DQ1_2) D18.12(In)
NetD13_16: D13.16(DQ1_3) D18.9(In)
NetD14_1: D14.1(Anod) R190.2
NetD14_2: D14.2(Katot) XT26.1
NetD15_1: D15.1(Anod) R191.2
NetD15_2: D15.2(Katot) XT26.2
NetD16_1: D16.1(Anod) R192.2
NetD16_2: D16.2(Katot) XT27.1
NetD17_1: D17.1(Anod) R193.2
NetD17_2: D17.2(Katot) XT27.2
NetD18_1: D18.1(Out) D19.9(In)
NetD18_4: D18.4(Out) D19.5(In)
NetD18_10: D18.10(Out) D19.13(In)
NetD18_13: D18.13(Out) D19.11(In)
NetD20_3: D20.3(FB) R195.2 R196.2
NetD22_11: D22.11(Vid) D23.1(RO)
NetD22_12: D22.12(Voc) D23.4(DI)
NetD22_14: D22.14(Voa) D23.2(~{RE}) D23.3(DE)
NetD23_6: D23.6(A) R202.1 XT33.1
NetD23_7: D23.7(B) R202.2 XT33.2
NetFU2_2: FU2.2 TR1.5 VS1.2
NetK1_1: K1.1(Anod) R197.2
NetK1_4: K1.4(K2) XT29.1
NetK1_6: K1.6(K1) XT29.2
NetK2_1: K2.1(Anod) R198.2
NetK2_4: K2.4(K2) XT30.1
NetK2_6: K2.6(K1) XT30.2
NetK3_1: K3.1(Anod) R199.2
NetK3_4: K3.4(K2) XT31.1
NetK3_6: K3.6(K1) XT31.2
NetK4_1: K4.1(Anod) R200.2
NetK4_4: K4.4(K2) XT32.1
NetK4_6: K4.6(K1) XT32.2
NetR201_1: R201.1 XT33.3
NetTR1_7: TR1.7 VD1.4
NetTR1_9: TR1.9 VD1.3

Not connected (* = marked no-connect by the designer): D13 8(DQ0_4) 9(DQ0_5) 10(DQ0_6) 11(DQ0_7); D19 2(Out) 4(Out); D22 7(Ve1) 10(Ve2) 13(Vob); K1 3 5; K2 3 5; K3 3 5; K4 3 5; TR1 2 3 4 6 8 10; XS1 8 10 12 16 17 19 20

### Buses and harness runs
bus BUS00009[1..3]

### Notes on the sheet
- на лист 3
- К плате ЦПУ
- К плате беспроводной связи
- Подп. и дата
- Инв. № дубл.
- Взам. инв. №
- Инв. № подл.
- Лист
- Изм.
- № докум.
- Подп.
- Дата
- (in symbol EK508V-02P) Цепь; Конт.
- (in symbol EK508V-03P) Конт.; Цепь
- (in symbol PBD-20WRLES) Цепь; Конт.
- (in symbol ST3485EBD) RS
- (in symbol TME0505S) DC/DC
- (in symbol Р0805_VARIANT_1) 3,3к; 82к; 430к

### Library data of the parts
C85 = К50-35: КОНДЕНСАТОР; TU: ОЖ0.464.214 ТУ; TO: -В; NO: {NO}; RefDes2: {RefDes2}; ComponentHeight: {ComponentHeight}
C86 C88-C91 = К0805: as C1 on sheet Sheet1; ComponentHeight: 1
C87 = К0805_VARIANT_1: КОНДЕНСАТОР; TG: NP0; TO: 5%; TU: {TU}; NO: {NO}; RefDes2: {RefDes2}; ComponentHeight: 1
D13 = PCA9555PW: {Description}; TG: {TG}; TO: {TO}; NO: {NO}; TU: {TU}; ComponentHeight: {ComponentHeight}
D14-D17 = PC817: {Description}; TO: {TO}; NO: {NO}; RefDes2: {RefDes2}; TU: {TU}; TG: {TG}; ComponentHeight: {ComponentHeight}
D18 = 74AHC02D: {Description}; TU: {TU}; TO: {TO}; TG: {TG}; NO: {NO}; RefDes2: {RefDes2}; ComponentHeight: {ComponentHeight}
D19 = 74AHC04D: {Description}; TU: {TU}; TO: {TO}; TG: {TG}; NO: {NO}; RefDes2: {RefDes2}; ComponentHeight: {ComponentHeight}
D20 = AP5100WG-7: {Description}; TU: {TU}; TO: {TO}; TG: {TG}; NO: {NO}; ComponentHeight: {ComponentHeight}
D21 = TME0505S: as D2 on sheet Sheet1; ComponentHeight: 10
D23 = ST3485EBD: {Description}; TU: {TU}; TG: {TG}; RefDes2: {RefDes2}; TO: {TO}; NO: {NO}; ComponentHeight: {ComponentHeight}
FU2 = LB080F: as FU1 on sheet Sheet3; ComponentHeight: {ComponentHeight}
K1-K4 = KAQV214A: {Description}; TG: {TG}; TU: {TU}; RefDes2: {RefDes2}; NO: {NO}; TO: {TO}; ComponentHeight: {ComponentHeight}
L1 = SRN3015-101M: {Description}; TU: {TU}; TO: {TO}; TG: {TG}; NO: {NO}; RefDes2: {RefDes2}; ComponentHeight: {ComponentHeight}
R189-R194 R197-R201 = Р0805_VARIANT_1: as R11 on sheet Sheet1; ComponentHeight: 1
R195 R196 = Р0805_VARIANT_1: РЕЗИСТОР; TG: 0,125; TO: 5%; TU: {TU}; NO: {NO}; RefDes2: {RefDes2}; ComponentHeight: 1
R202 = Р0805: as R1 on sheet Sheet1; ComponentHeight: 1
TR1 = EI305-2052: {Description}; Value: *; ComponentHeight: {ComponentHeight}
VD1 = MB05S: {Description}; TU: {TU}; TG: {TG}; RefDes2: {RefDes2}; TO: {TO}; NO: {NO}; ComponentHeight: {ComponentHeight}
VD2 = MBRA340T3G: {Description}; TU: {TU}; TG: {TG}; RefDes2: {RefDes2}; TO: {TO}; NO: {NO}; ComponentHeight: {ComponentHeight}
VS1 = B72207S0251K101: {Description}; TO: {TO}; NO: {NO}; RefDes2: {RefDes2}; TU: {TU}; TG: {TG}; ComponentHeight: {ComponentHeight}
XS1-XS3 = PBD-20WRLES: {Description}; TU: {TU}; TG: {TG}; RefDes2: {RefDes2}; TO: {TO}; NO: {NO}; ComponentHeight: {ComponentHeight}
XT25-XT27 XT29-XT32 = EK508V-02P: as XT1 on sheet Sheet1; ComponentHeight: {ComponentHeight}
XT33 = EK508V-03P: as XT17 on sheet Sheet3; ComponentHeight: {ComponentHeight}

## Nets that join several sheets
+3,3V: Sheet1 (D2.2 D3.1 D5.2 D6.1), Sheet4 (12 pins)
GND: Sheet1 (6 pins), Sheet4 (34 pins)
GND1: Sheet1 (33 pins), Sheet3 (10 pins)
GND2: Sheet1 (33 pins), Sheet3 (9 pins)
NPOWER: Sheet3 (FU1.2), Sheet4 (TR1.1 VS1.1)
SPI1_CS1: Sheet1 (D3.5), Sheet4 (D19.6)
SPI1_CS2: Sheet1 (D6.5), Sheet4 (D19.8)
SPI1_MISO: Sheet1 (D3.6 D6.6), Sheet4 (XS1.4)
SPI1_MOSI: Sheet1 (D3.3 D6.3), Sheet4 (XS1.1)
SPI1_SCK: Sheet1 (D3.4 D6.4), Sheet4 (XS1.2)
UPOWER: Sheet3 (R101.1 XT17.1), Sheet4 (FU2.1)